# EAGLE design Driver velocidad DCmotor (EAGLE 7.1.0)
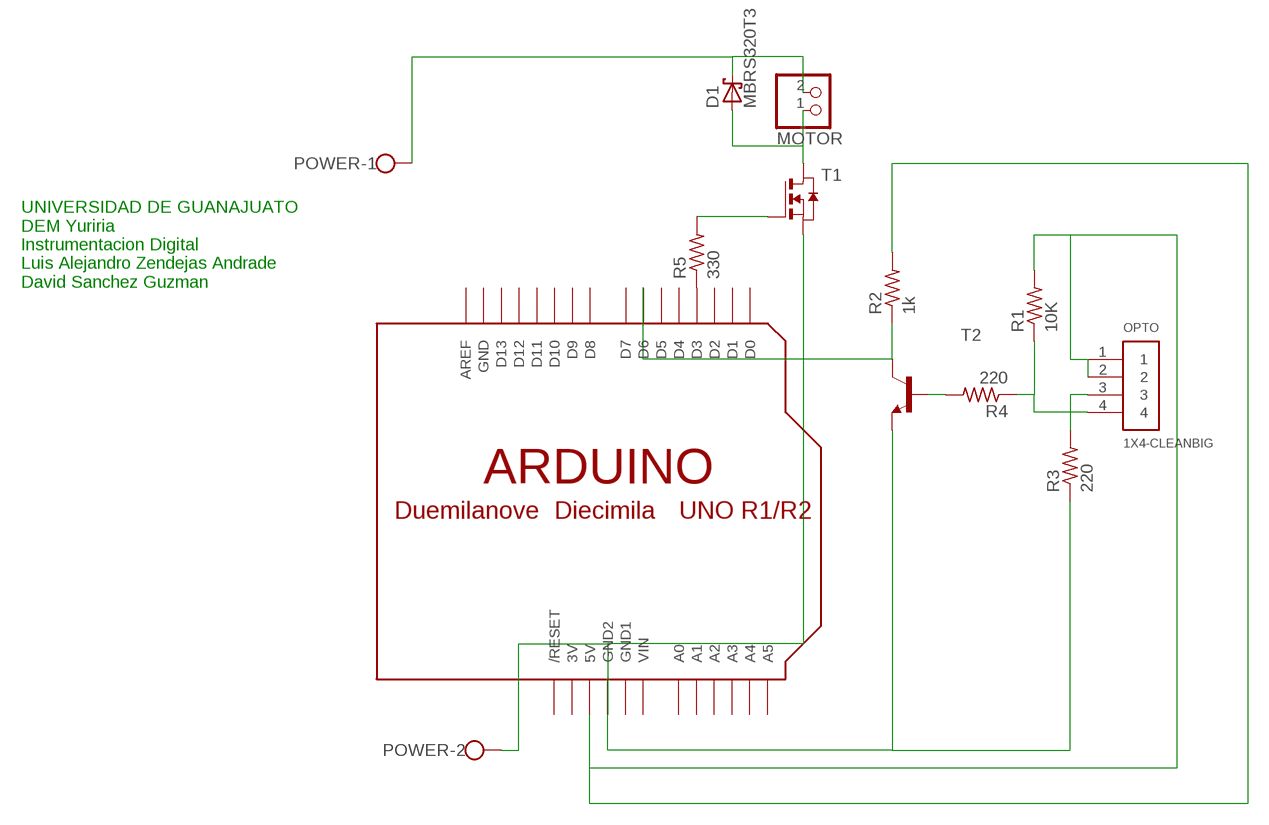
[diagram p0: schematic, sheet 1]

## Parts
D1  MBRS320T3  [SMC]
MOTOR  PINHD-1X2  [1X02]
OPTO  1X4-CLEANBIG  [1X04-CLEANBIG]
POWER  W237-102  [W237-102]
R1  10K  R-US_M1206  [M1206]
R2  1k  R-US_M1206  [M1206]
R3  220  R-US_M1206  [M1206]
R4  220  R-US_M1206  [M1206]
R5  330  R-US_M1206  [M1206]
T1  NMOSSOT223  [SOT223]
T2  BC817-16-NPN-SOT23-BEC  [SOT23-BEC]
U$1  ARDUINO-NOHOLE  [ARDUINO-NOHOLE]

## Nets
N$1: POWER.2 R3.1 T1.3(S) T2.E U$1.GND2
N$2: OPTO.1 OPTO.2 R1.2 R2.2 U$1.5V
N$3: D1.A MOTOR.1 T1.2(D) T1.4(D)
N$4: OPTO.4 R1.1 R4.1
N$5: R4.2 T2.B
N$6: R2.1 T2.C U$1.D6
N$7: OPTO.3 R3.2
N$8: R5.2 T1.1(G)
N$10: D1.C MOTOR.2 POWER.1
N$15: R5.1 U$1.D3
Unconnected: U$1.A0 U$1.A1 U$1.A2 U$1.A3 U$1.A4 U$1.A5 U$1.AREF U$1.D0 U$1.D1 U$1.D2 U$1.D4 U$1.D5 U$1.D7 U$1.D8 U$1.D9 U$1.D10 U$1.D11 U$1.D12 U$1.D13 U$1.RESET(/RESET)

## Notes on the sheet
- UNIVERSIDAD DE GUANAJUATO 
  DEM Yuriria
  Instrumentacion Digital
  Luis Alejandro Zendejas Andrade
  David Sanchez Guzman

## Power pins joined to a net without a drawn wire
3V: U$1.3V
GND: U$1.GND
GND1: U$1.GND1
VIN: U$1.VIN

## Library data of the parts
D1 = diode:MBRS3*0T3: SCHOTTKY BARRIER RECTIFIER 3.0 AMPERES 20, 30, 40 VOLT Source: MBRS340T3-D.pdf
MOTOR = pinhead:PINHD-1X2: PIN HEADER
OPTO = adafruit:1X4: 4-pin connector
POWER = con-wago-500:W237-102: WAGO SCREW CLAMP; MPN: 237-102; OC_FARNELL: unknown; OC_NEWARK: 70K9898
R1-R5 = adafruit:R-US_: RESISTOR, American symbol
T1 = zetex:NMOSSOT223: MOS FET; OC_FARNELL: unknown; OC_NEWARK: unknown
T2 = transistor:*-NPN-: NPN Transistror BF959 corrected 2008.03.06
U$1 = adafruit:ARDUINO: Arduino Diecimila/Duemilanove Make a shield with ease, this package has all the named pins as well as the two mounting drill holes and an outline of the USB and DC power connector. The outline is on the DIMENSION layer, so if your board house uses it they will cut the outline to match. http://www.ladyada.net/library/pcb/eaglelibrary.html

## Board
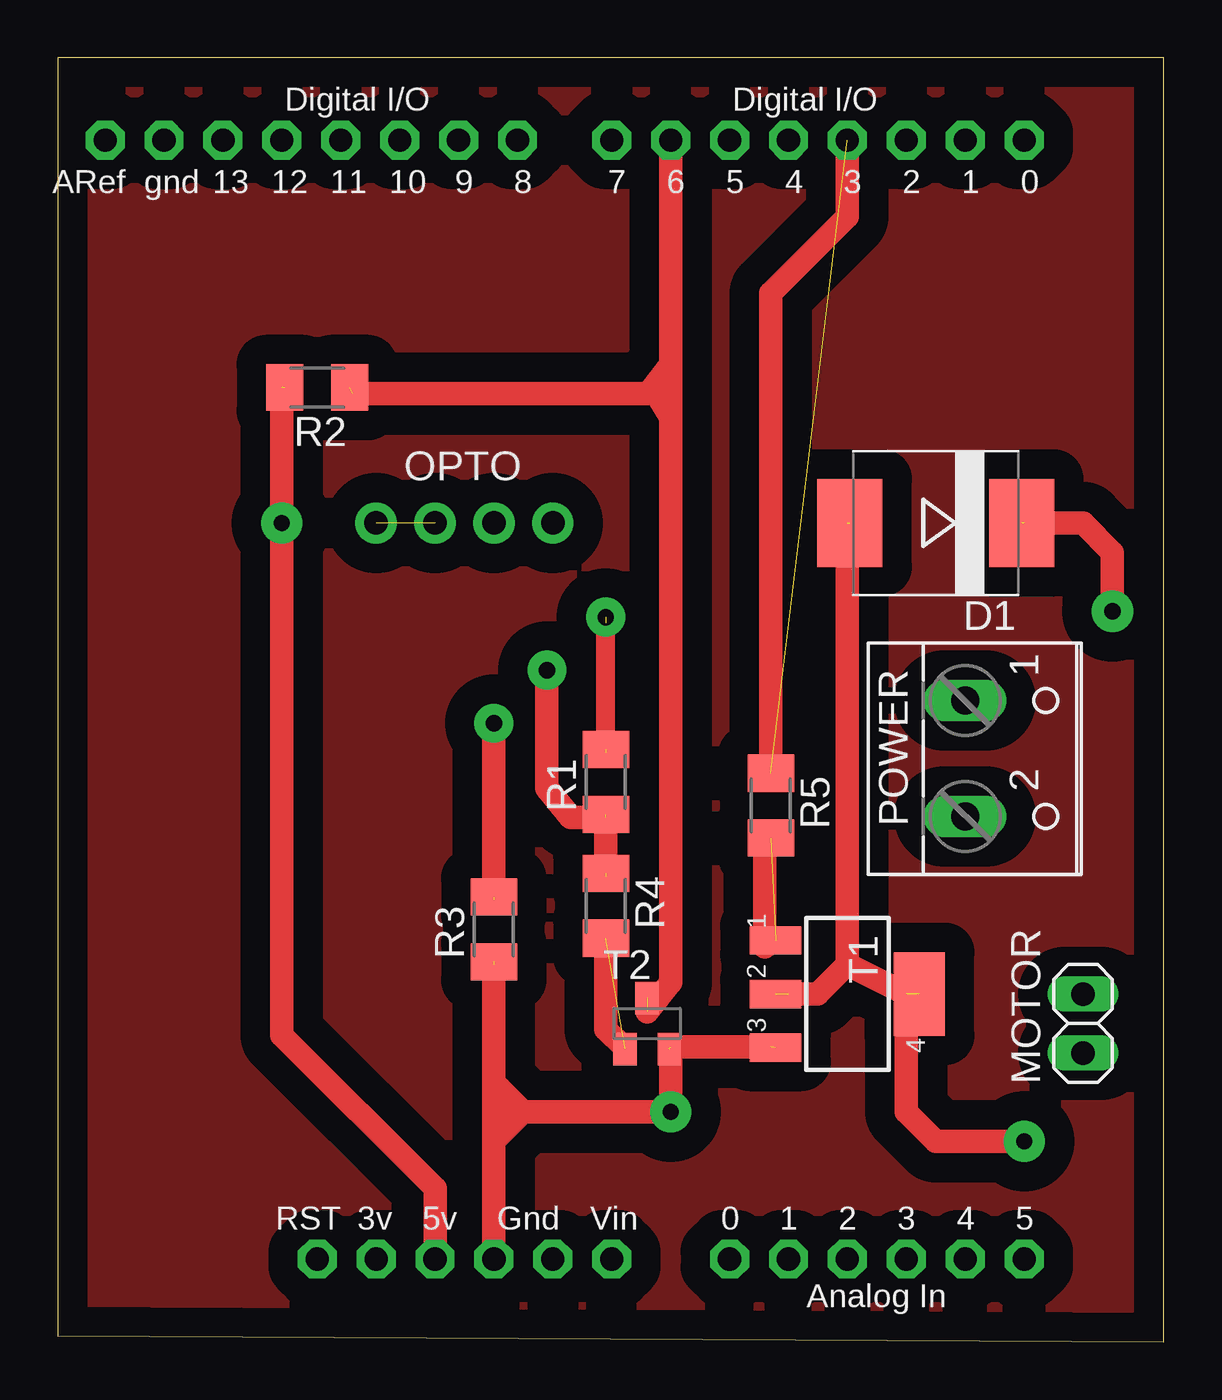
[diagram p1: board, top side]
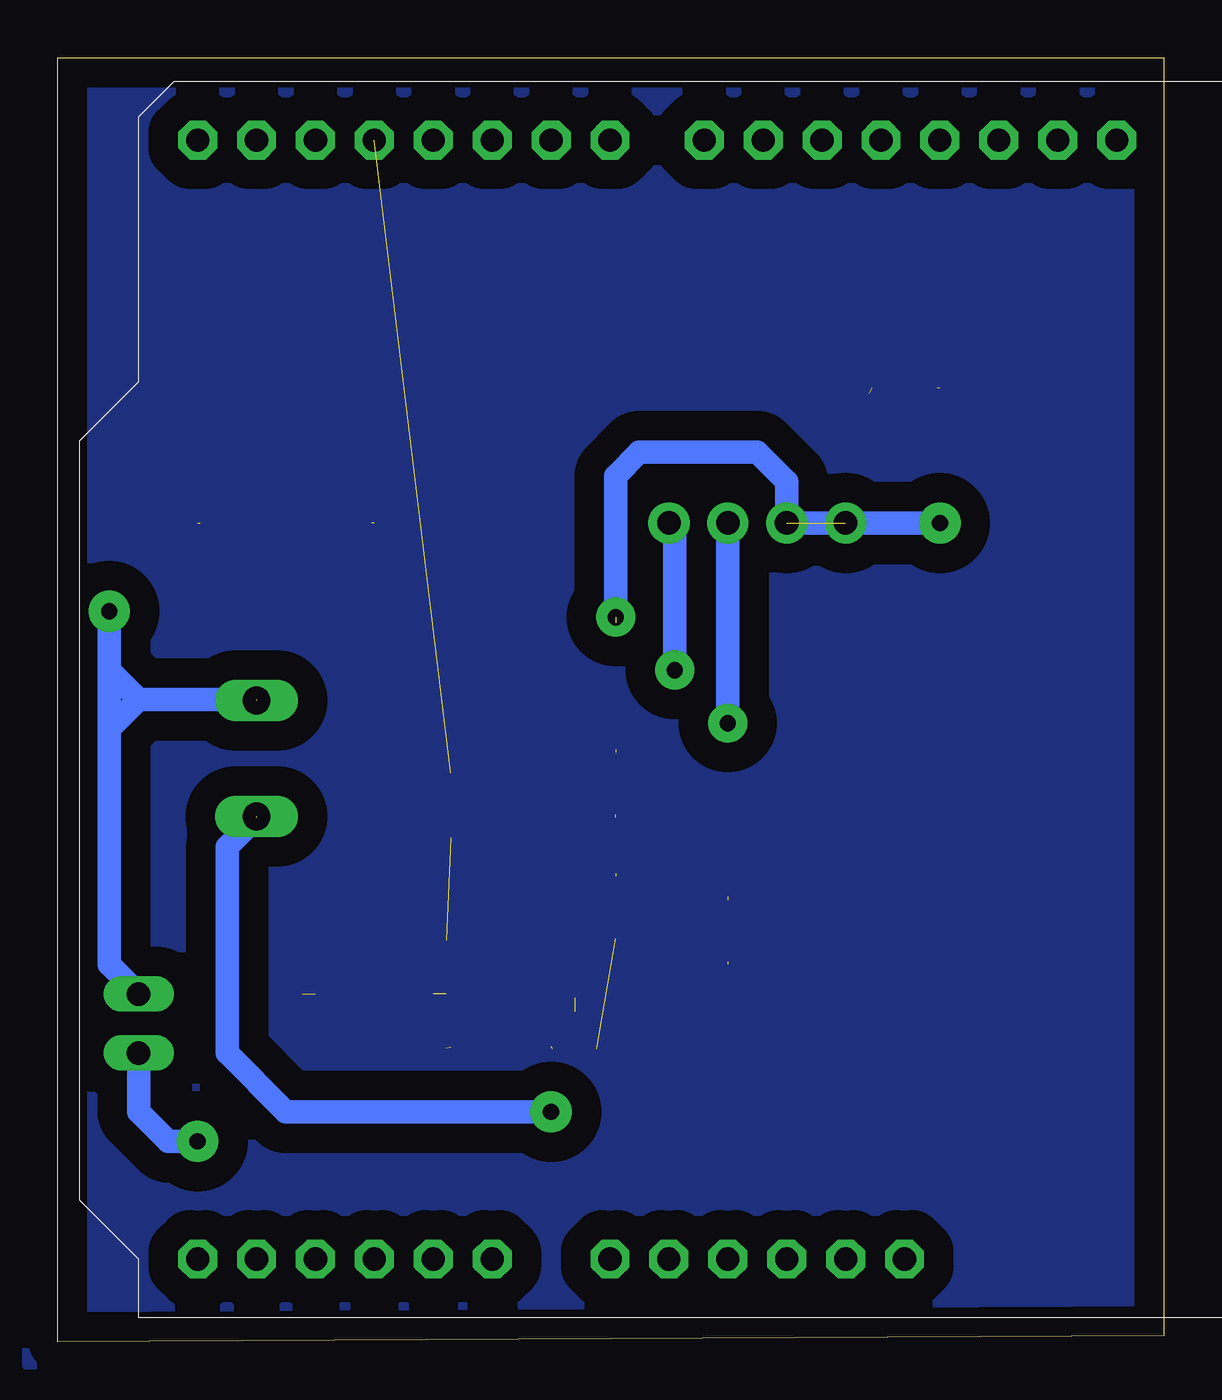
[diagram p2: board, bottom side, seen from below]

Size 47.68 x 55.36 mm. Coordinates in mm from the lower left corner, seen from the top.
Outline: 0,0.25 47.68,0 47.68,55.36 0,55.36 0,0.25
Copper layers (1*16): Top 0.035mm / dielectric 1.5mm / Bottom 0.035mm
Design rules "default": minimum track width 10mil, minimum drill 24mil, track to track 8mil, track to pad 8mil, pad to pad 8mil, via to via 8mil, smd to smd 8mil, copper to edge 40mil, drill to drill 8mil, minimum pad ring 10mil, minimum via ring 8mil, stop-mask expansion 4mil, vias tented up to drill 0mil, thermal gap 10mil

### Footprints (pad centres in the part's own frame; a part is rotated, then mirrored left to right if it is on the bottom)
SMC = smd 2.8 x 3.8: A 3.7,0; C -3.7,0
1X02 = drill 1.016 long: 1 -1.27,0; 2 1.27,0
1X04-CLEANBIG = drill 1.016 pad 1.778: 1 -3.81,0; 2 -1.27,0; 3 1.27,0; 4 3.81,0
W237-102 = drill 1.194 long: 1 -2.5,-1.27; 2 2.5,-1.27
M1206 = smd 1.6 x 2: 1 -1.4,0; 2 1.4,0
SOT223 = smd 1.219 x 2.235: 1 -2.311,-3.099; 2 0,-3.099; 3 2.311,-3.099 | smd 3.6 x 2.2: 4 0,3.099
SOT23-BEC = smd 1 x 1.4: B -0.95,-1.1; C 0,1.1; E 0.95,-1.1
ARDUINO-NOHOLE = drill 1 pad 1.676 octagon: 3V 35.56,2.54; 5V 38.1,2.54; A0 50.8,2.54; A1 53.34,2.54; A2 55.88,2.54; A3 58.42,2.54; A4 60.96,2.54; A5 63.5,2.54; AREF 23.876,50.8; D0 63.5,50.8; D1 60.96,50.8; D2 58.42,50.8; D3 55.88,50.8; D4 53.34,50.8; D5 50.8,50.8; D6 48.26,50.8; D7 45.72,50.8; D8 41.656,50.8; D9 39.116,50.8; D10 36.576,50.8; D11 34.036,50.8; D12 31.496,50.8; D13 28.956,50.8; GND 26.416,50.8; GND1 43.18,2.54; GND2 40.64,2.54; RESET 33.02,2.54; VIN 45.72,2.54

### Placement (x,y rotation side)
D1  37.85,35.31 180 top
MOTOR  44.2,13.72 90 top
OPTO  17.53,35.31 0 top
POWER  40.39,25.15 270 top
R1  23.62,24.13 90 top
R2  11.18,41.15 180 top
R3  18.8,17.78 90 top
R4  23.62,18.8 270 top
R5  30.73,23.11 270 top
T1  34.04,14.99 270 top
T2  25.4,13.72 0 top
U$1  -21.84,1.02 0 top

### Tracks (layer width: path | path; a pad name or v marks a point on that pad's centre or on a via)
N$1  (via drill 0.7 pad 1.78)  (4 unrouted)
  Top 0.813: 20.07,9.91 18.8,9.91 | 19.05,10.92 18.8,10.92
  Top 1.016: 30.73,12.7 26.42,12.7 v26.42,9.91 20.07,9.91 | 18.8,8.64 18.8,9.91 18.8,10.92 18.8,16.26 | 18.8,8.64 U$1.GND2 | 18.8,8.64 20.07,9.91 | 20.07,9.91 19.05,10.92
  Bottom 1.016: 39.12,22.61 40.39,21.34 40.39,12.45 37.85,9.91 v26.42,9.91
N$2  (via drill 0.7 pad 1.68, 0.7 pad 1.78)  (4 unrouted)
  Top 0.813: 23.62,25.4 v23.62,31.24
  Top 1.016: U$1.5V 16.26,6.6 9.65,13.21 v9.65,35.31 9.65,41.15
  Bottom 1.016: 23.62,30.99 23.62,37.34 22.61,38.35 17.53,38.35 16.26,37.08 OPTO.2 v9.65,35.31
N$3  (via drill 0.7 pad 1.78)  (3 unrouted)
  Top 1.016: 31.5,14.99 32.77,14.99 34.04,16.26 | 34.04,16.26 34.04,35.31 | 34.04,16.26 36.58,14.99 36.58,9.91 37.85,8.64 v41.66,8.64
  Bottom 1.016: v41.66,8.64 42.93,8.64 44.2,9.91 MOTOR.1
N$4  (via drill 0.7 pad 1.68)  (2 unrouted)
  Top 1.016: v21.08,28.96 21.08,23.88 22.1,22.61 23.62,22.61 23.62,20.07
  Bottom 0.813: OPTO.4 21.08,34.8
  Bottom 1.016: 21.08,34.8 v21.08,28.96
N$5  (1 unrouted)
N$6  (2 unrouted)
  Top 1.016: 25.4,14.22 26.42,15.49 26.42,39.88 | 26.42,39.88 26.42,40.89 | 26.42,40.89 26.42,42.16 | 26.42,42.16 U$1.D6 | 12.7,40.89 26.42,40.89 | 26.42,42.16 25.65,41.15 26.42,39.88
N$7  (via drill 0.7 pad 1.68)  (1 unrouted)
  Top 1.016: 18.8,19.05 v18.8,26.67
  Bottom 1.016: v18.8,26.67 OPTO.3
N$8  (1 unrouted)
N$9
  Top 1.016: 23.62,17.27 23.62,13.46 24.38,12.7
N$10  (via drill 0.7 pad 1.78)  (2 unrouted)
  Top 1.016: 41.66,35.31 44.2,35.31 45.47,34.04 v45.47,31.5
  Bottom 1.016: MOTOR.2 45.47,16.26 45.47,26.42 | v45.47,31.5 45.47,28.96 | 44.2,27.69 39.12,27.69 | 45.47,26.42 45.47,28.96 | 45.47,28.96 44.2,27.69 | 44.2,27.69 45.47,26.42
N$12
  pour Bottom (isolate 1.27): -0.25,55.63 48.77,55.88 49.02,-1.02 -0.25,-0.25
N$13
  pour Top (isolate 1.27): -0.51,55.63 48.26,55.63 48.01,0 -0.51,0
N$14
  Top 1.016: 30.48,17.02 30.48,21.59
N$15  (1 unrouted)
  Top 1.016: 30.73,24.38 30.73,45.21 34.04,48.51 U$1.D3